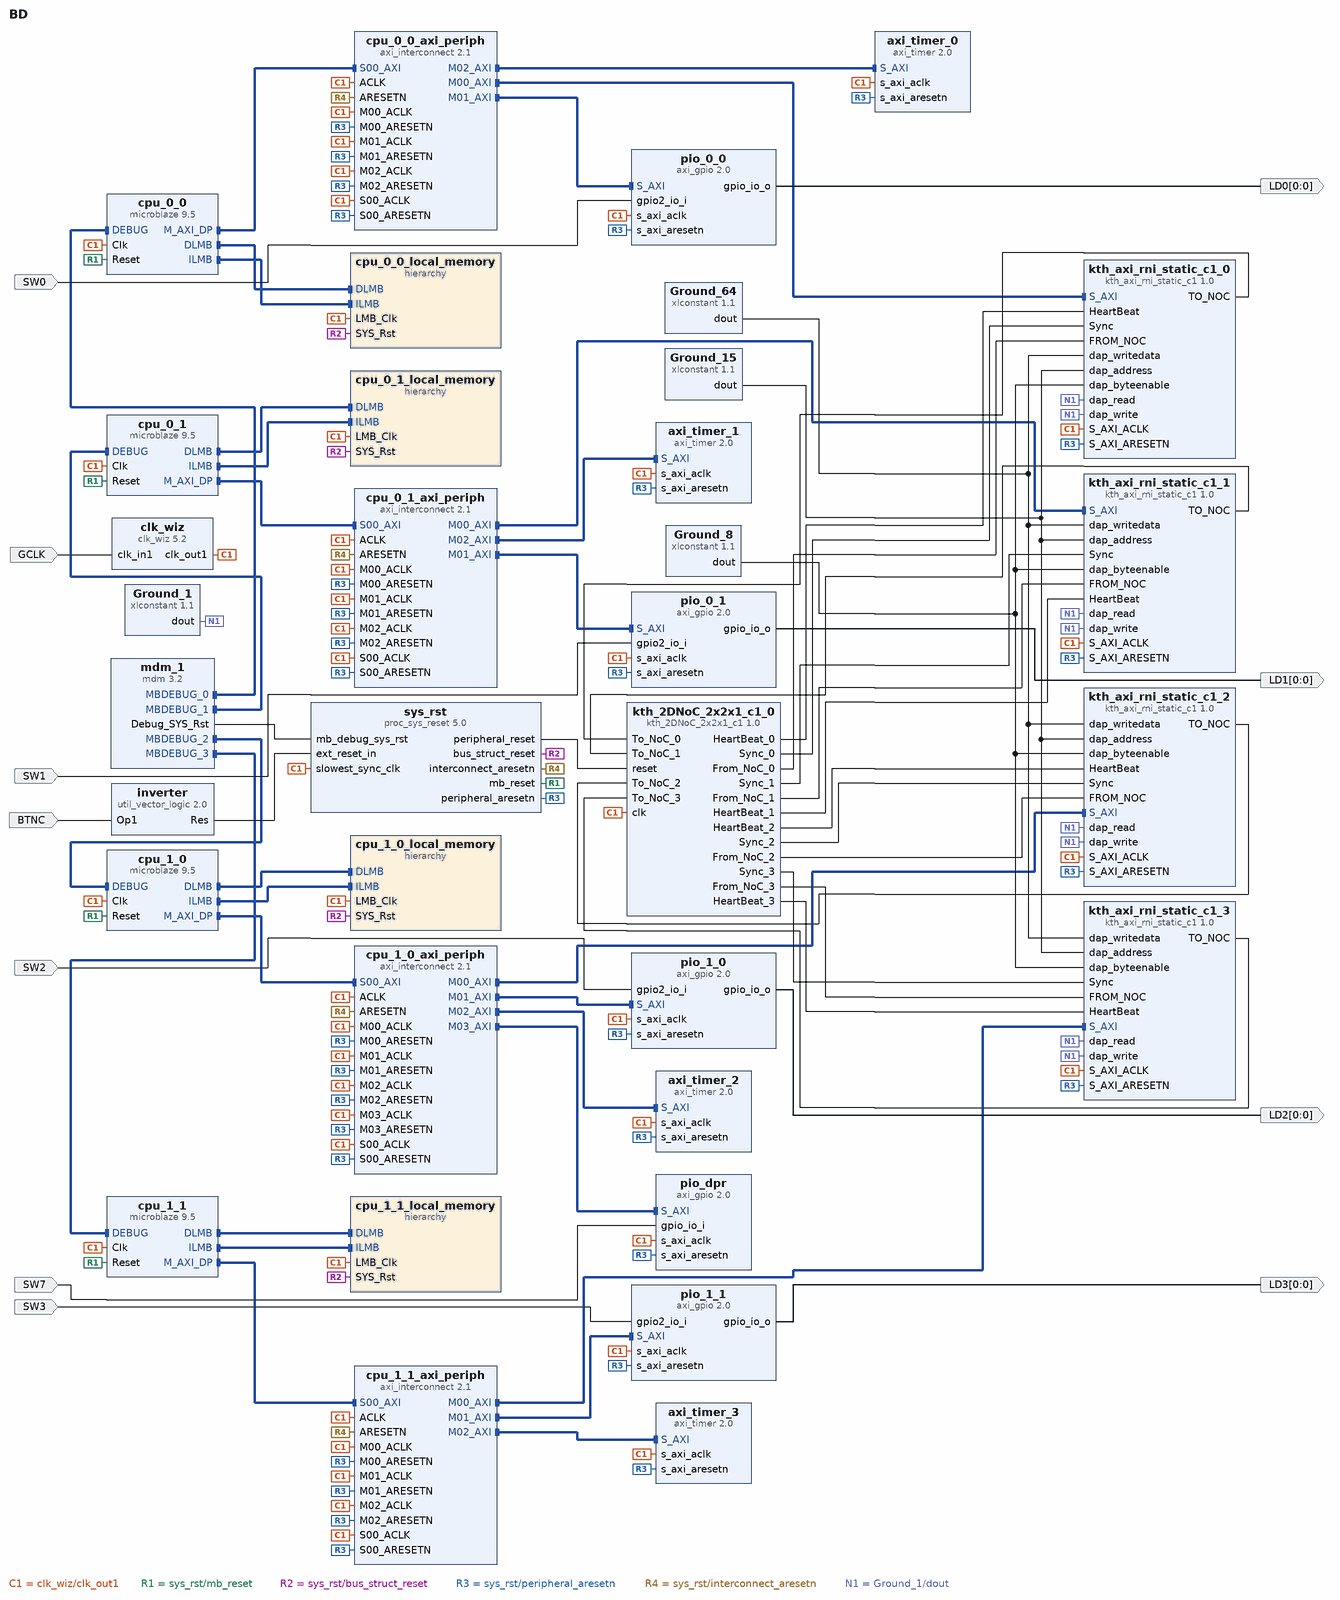
[diagram p0: block diagram of the top level]
# Vivado block design BD, Vivado 2015.4
create_bd_design BD

create_bd_port -dir I GCLK
create_bd_port -dir O -from 0 -to 0 LD0
create_bd_port -dir I SW0
create_bd_port -dir O -from 0 -to 0 LD1
create_bd_port -dir I SW1
create_bd_port -dir O -from 0 -to 0 LD2
create_bd_port -dir I SW2
create_bd_port -dir I SW7
create_bd_port -dir O -from 0 -to 0 LD3
create_bd_port -dir I SW3
create_bd_port -dir I BTNC

create_bd_cell -type ip -vlnv xilinx.com:ip:clk_wiz:5.2 clk_wiz
set_property -dict [list \
  CONFIG.CLKOUT1_REQUESTED_OUT_FREQ 50 \
  CONFIG.USE_LOCKED false \
  CONFIG.USE_RESET false \
  CONFIG.MMCM_DIVCLK_DIVIDE 1 \
  CONFIG.MMCM_CLKOUT0_DIVIDE_F 20.000 \
  CONFIG.CLKOUT1_JITTER 151.636 \
] [get_bd_cells clk_wiz]
create_bd_cell -type ip -vlnv xilinx.com:ip:microblaze:9.5 cpu_0_0
set_property -dict {CONFIG.C_D_AXI 1 CONFIG.C_D_LMB 1 CONFIG.C_I_LMB 1 CONFIG.C_DEBUG_ENABLED 1} [get_bd_cells cpu_0_0]
create_bd_cell -type ip -vlnv kth.se:tage:kth_axi_rni_static_c1:1.0 kth_axi_rni_static_c1_0
set_property -dict {CONFIG.rni_pos 0 CONFIG.use_64bit 0 CONFIG.rni_number 0} [get_bd_cells kth_axi_rni_static_c1_0]
create_bd_cell -type ip -vlnv xilinx.com:ip:axi_gpio:2.0 pio_0_0
set_property -dict [list \
  CONFIG.C_GPIO_WIDTH 1 \
  CONFIG.C_GPIO2_WIDTH 1 \
  CONFIG.C_IS_DUAL 1 \
  CONFIG.C_ALL_INPUTS 0 \
  CONFIG.C_ALL_INPUTS_2 1 \
  CONFIG.C_ALL_OUTPUTS 1 \
] [get_bd_cells pio_0_0]
create_bd_cell -type ip -vlnv xilinx.com:ip:axi_timer:2.0 axi_timer_0
create_bd_cell -type hier cpu_0_0_local_memory
create_bd_cell -type ip -vlnv xilinx.com:ip:mdm:3.2 mdm_1
set_property -dict {CONFIG.C_MB_DBG_PORTS 4} [get_bd_cells mdm_1]
create_bd_cell -type ip -vlnv xilinx.com:ip:proc_sys_reset:5.0 sys_rst
create_bd_cell -type ip -vlnv xilinx.com:ip:axi_interconnect:2.1 cpu_0_0_axi_periph
set_property -dict {CONFIG.NUM_MI 3} [get_bd_cells cpu_0_0_axi_periph]
create_bd_cell -type ip -vlnv xilinx.com:ip:microblaze:9.5 cpu_0_1
set_property -dict {CONFIG.C_D_AXI 1 CONFIG.C_D_LMB 1 CONFIG.C_I_LMB 1 CONFIG.C_DEBUG_ENABLED 1} [get_bd_cells cpu_0_1]
create_bd_cell -type ip -vlnv kth.se:tage:kth_axi_rni_static_c1:1.0 kth_axi_rni_static_c1_1
set_property -dict {CONFIG.rni_pos 1 CONFIG.use_64bit 0 CONFIG.rni_number 1} [get_bd_cells kth_axi_rni_static_c1_1]
create_bd_cell -type ip -vlnv xilinx.com:ip:axi_gpio:2.0 pio_0_1
set_property -dict [list \
  CONFIG.C_GPIO_WIDTH 1 \
  CONFIG.C_GPIO2_WIDTH 1 \
  CONFIG.C_IS_DUAL 1 \
  CONFIG.C_ALL_INPUTS 0 \
  CONFIG.C_ALL_INPUTS_2 1 \
  CONFIG.C_ALL_OUTPUTS 1 \
] [get_bd_cells pio_0_1]
create_bd_cell -type ip -vlnv xilinx.com:ip:axi_timer:2.0 axi_timer_1
create_bd_cell -type hier cpu_0_1_local_memory
create_bd_cell -type ip -vlnv xilinx.com:ip:axi_interconnect:2.1 cpu_0_1_axi_periph
set_property -dict {CONFIG.NUM_MI 3} [get_bd_cells cpu_0_1_axi_periph]
create_bd_cell -type ip -vlnv xilinx.com:ip:microblaze:9.5 cpu_1_0
set_property -dict {CONFIG.C_D_AXI 1 CONFIG.C_D_LMB 1 CONFIG.C_I_LMB 1 CONFIG.C_DEBUG_ENABLED 1} [get_bd_cells cpu_1_0]
create_bd_cell -type ip -vlnv kth.se:tage:kth_axi_rni_static_c1:1.0 kth_axi_rni_static_c1_2
set_property -dict {CONFIG.rni_pos 2 CONFIG.use_64bit 0 CONFIG.rni_number 2} [get_bd_cells kth_axi_rni_static_c1_2]
create_bd_cell -type ip -vlnv xilinx.com:ip:axi_gpio:2.0 pio_1_0
set_property -dict [list \
  CONFIG.C_GPIO_WIDTH 1 \
  CONFIG.C_GPIO2_WIDTH 1 \
  CONFIG.C_IS_DUAL 1 \
  CONFIG.C_ALL_INPUTS 0 \
  CONFIG.C_ALL_INPUTS_2 1 \
  CONFIG.C_ALL_OUTPUTS 1 \
] [get_bd_cells pio_1_0]
create_bd_cell -type ip -vlnv xilinx.com:ip:axi_timer:2.0 axi_timer_2
create_bd_cell -type hier cpu_1_0_local_memory
create_bd_cell -type ip -vlnv xilinx.com:ip:axi_interconnect:2.1 cpu_1_0_axi_periph
set_property -dict {CONFIG.NUM_MI 4} [get_bd_cells cpu_1_0_axi_periph]
create_bd_cell -type ip -vlnv xilinx.com:ip:axi_gpio:2.0 pio_dpr
set_property -dict {CONFIG.C_GPIO_WIDTH 1 CONFIG.C_IS_DUAL 0 CONFIG.C_ALL_INPUTS 1} [get_bd_cells pio_dpr]
create_bd_cell -type ip -vlnv xilinx.com:ip:microblaze:9.5 cpu_1_1
set_property -dict {CONFIG.C_D_AXI 1 CONFIG.C_D_LMB 1 CONFIG.C_I_LMB 1 CONFIG.C_DEBUG_ENABLED 1} [get_bd_cells cpu_1_1]
create_bd_cell -type ip -vlnv kth.se:tage:kth_axi_rni_static_c1:1.0 kth_axi_rni_static_c1_3
set_property -dict {CONFIG.rni_pos 3 CONFIG.use_64bit 0 CONFIG.rni_number 3} [get_bd_cells kth_axi_rni_static_c1_3]
create_bd_cell -type ip -vlnv xilinx.com:ip:axi_gpio:2.0 pio_1_1
set_property -dict [list \
  CONFIG.C_GPIO_WIDTH 1 \
  CONFIG.C_GPIO2_WIDTH 1 \
  CONFIG.C_IS_DUAL 1 \
  CONFIG.C_ALL_INPUTS 0 \
  CONFIG.C_ALL_INPUTS_2 1 \
  CONFIG.C_ALL_OUTPUTS 1 \
] [get_bd_cells pio_1_1]
create_bd_cell -type ip -vlnv xilinx.com:ip:axi_timer:2.0 axi_timer_3
create_bd_cell -type hier cpu_1_1_local_memory
create_bd_cell -type ip -vlnv xilinx.com:ip:axi_interconnect:2.1 cpu_1_1_axi_periph
set_property -dict {CONFIG.NUM_MI 3} [get_bd_cells cpu_1_1_axi_periph]
create_bd_cell -type ip -vlnv xilinx.com:ip:util_vector_logic:2.0 inverter
set_property -dict {CONFIG.C_SIZE 1 CONFIG.C_OPERATION not} [get_bd_cells inverter]
create_bd_cell -type ip -vlnv kth.se:tage:kth_2DNoC_2x2x1_c1:1.0 kth_2DNoC_2x2x1_c1_0
set_property -dict {CONFIG.HeartBeatTimerConst 500} [get_bd_cells kth_2DNoC_2x2x1_c1_0]
create_bd_cell -type ip -vlnv xilinx.com:ip:xlconstant:1.1 Ground_1
set_property -dict {CONFIG.CONST_VAL 0} [get_bd_cells Ground_1]
create_bd_cell -type ip -vlnv xilinx.com:ip:xlconstant:1.1 Ground_8
set_property -dict {CONFIG.CONST_WIDTH 8 CONFIG.CONST_VAL 0} [get_bd_cells Ground_8]
create_bd_cell -type ip -vlnv xilinx.com:ip:xlconstant:1.1 Ground_15
set_property -dict {CONFIG.CONST_WIDTH 15 CONFIG.CONST_VAL 0} [get_bd_cells Ground_15]
create_bd_cell -type ip -vlnv xilinx.com:ip:xlconstant:1.1 Ground_64
set_property -dict {CONFIG.CONST_WIDTH 64 CONFIG.CONST_VAL 0} [get_bd_cells Ground_64]

# ---- hierarchy /cpu_0_0_local_memory ----
current_bd_instance /cpu_0_0_local_memory
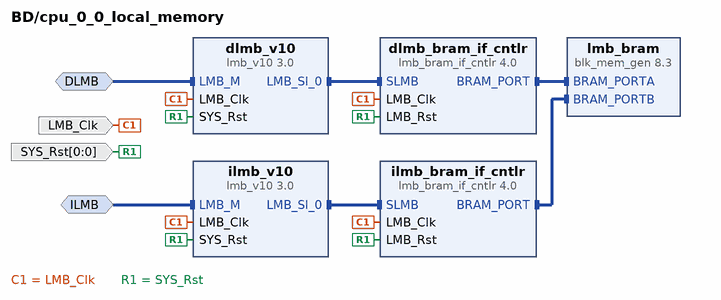
[diagram p1: block diagram inside /cpu_0_0_local_memory]
create_bd_intf_pin -mode MirroredMaster -vlnv xilinx.com:interface:lmb_rtl:1.0 DLMB
create_bd_intf_pin -mode MirroredMaster -vlnv xilinx.com:interface:lmb_rtl:1.0 ILMB
create_bd_pin -dir I -type clk LMB_Clk
create_bd_pin -dir I -from 0 -to 0 -type rst SYS_Rst

create_bd_cell -type ip -vlnv xilinx.com:ip:lmb_v10:3.0 dlmb_v10
create_bd_cell -type ip -vlnv xilinx.com:ip:lmb_v10:3.0 ilmb_v10
create_bd_cell -type ip -vlnv xilinx.com:ip:lmb_bram_if_cntlr:4.0 dlmb_bram_if_cntlr
set_property -dict {CONFIG.C_ECC 0} [get_bd_cells dlmb_bram_if_cntlr]
create_bd_cell -type ip -vlnv xilinx.com:ip:lmb_bram_if_cntlr:4.0 ilmb_bram_if_cntlr
set_property -dict {CONFIG.C_ECC 0} [get_bd_cells ilmb_bram_if_cntlr]
create_bd_cell -type ip -vlnv xilinx.com:ip:blk_mem_gen:8.3 lmb_bram
set_property -dict {CONFIG.Memory_Type True_Dual_Port_RAM CONFIG.use_bram_block BRAM_Controller} [get_bd_cells lmb_bram]

# ---- hierarchy /cpu_0_1_local_memory ----
current_bd_instance /cpu_0_1_local_memory
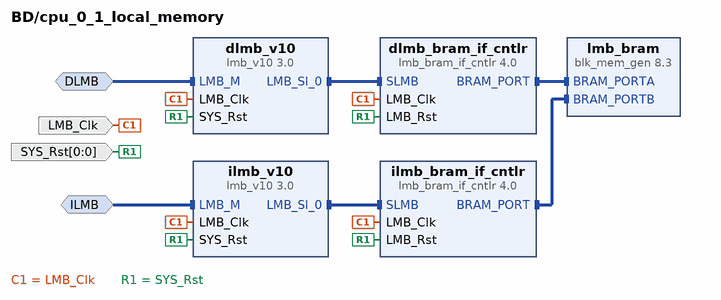
[diagram p2: block diagram inside /cpu_0_1_local_memory]
create_bd_intf_pin -mode MirroredMaster -vlnv xilinx.com:interface:lmb_rtl:1.0 DLMB
create_bd_intf_pin -mode MirroredMaster -vlnv xilinx.com:interface:lmb_rtl:1.0 ILMB
create_bd_pin -dir I -type clk LMB_Clk
create_bd_pin -dir I -from 0 -to 0 -type rst SYS_Rst

create_bd_cell -type ip -vlnv xilinx.com:ip:lmb_v10:3.0 dlmb_v10
create_bd_cell -type ip -vlnv xilinx.com:ip:lmb_v10:3.0 ilmb_v10
create_bd_cell -type ip -vlnv xilinx.com:ip:lmb_bram_if_cntlr:4.0 dlmb_bram_if_cntlr
set_property -dict {CONFIG.C_ECC 0} [get_bd_cells dlmb_bram_if_cntlr]
create_bd_cell -type ip -vlnv xilinx.com:ip:lmb_bram_if_cntlr:4.0 ilmb_bram_if_cntlr
set_property -dict {CONFIG.C_ECC 0} [get_bd_cells ilmb_bram_if_cntlr]
create_bd_cell -type ip -vlnv xilinx.com:ip:blk_mem_gen:8.3 lmb_bram
set_property -dict {CONFIG.Memory_Type True_Dual_Port_RAM CONFIG.use_bram_block BRAM_Controller} [get_bd_cells lmb_bram]

# ---- hierarchy /cpu_1_0_local_memory ----
current_bd_instance /cpu_1_0_local_memory
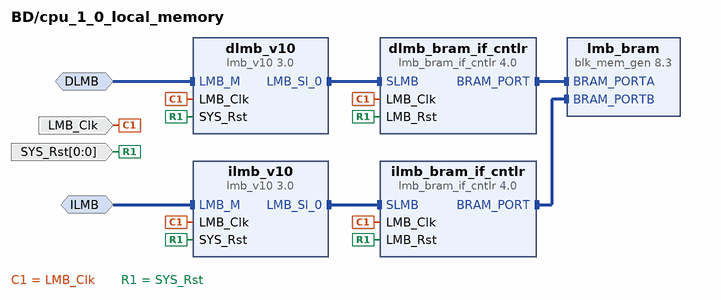
[diagram p3: block diagram inside /cpu_1_0_local_memory]
create_bd_intf_pin -mode MirroredMaster -vlnv xilinx.com:interface:lmb_rtl:1.0 DLMB
create_bd_intf_pin -mode MirroredMaster -vlnv xilinx.com:interface:lmb_rtl:1.0 ILMB
create_bd_pin -dir I -type clk LMB_Clk
create_bd_pin -dir I -from 0 -to 0 -type rst SYS_Rst

create_bd_cell -type ip -vlnv xilinx.com:ip:lmb_v10:3.0 dlmb_v10
create_bd_cell -type ip -vlnv xilinx.com:ip:lmb_v10:3.0 ilmb_v10
create_bd_cell -type ip -vlnv xilinx.com:ip:lmb_bram_if_cntlr:4.0 dlmb_bram_if_cntlr
set_property -dict {CONFIG.C_ECC 0} [get_bd_cells dlmb_bram_if_cntlr]
create_bd_cell -type ip -vlnv xilinx.com:ip:lmb_bram_if_cntlr:4.0 ilmb_bram_if_cntlr
set_property -dict {CONFIG.C_ECC 0} [get_bd_cells ilmb_bram_if_cntlr]
create_bd_cell -type ip -vlnv xilinx.com:ip:blk_mem_gen:8.3 lmb_bram
set_property -dict {CONFIG.Memory_Type True_Dual_Port_RAM CONFIG.use_bram_block BRAM_Controller} [get_bd_cells lmb_bram]

# ---- hierarchy /cpu_1_1_local_memory ----
current_bd_instance /cpu_1_1_local_memory
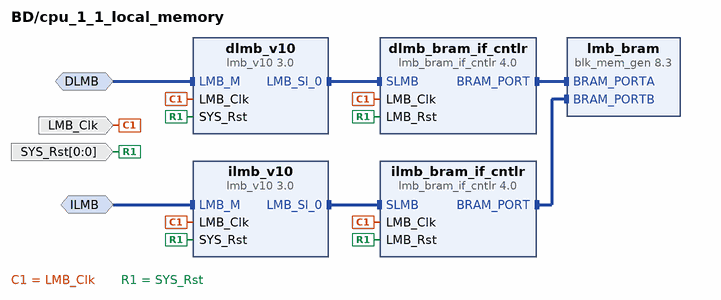
[diagram p4: block diagram inside /cpu_1_1_local_memory]
create_bd_intf_pin -mode MirroredMaster -vlnv xilinx.com:interface:lmb_rtl:1.0 DLMB
create_bd_intf_pin -mode MirroredMaster -vlnv xilinx.com:interface:lmb_rtl:1.0 ILMB
create_bd_pin -dir I -type clk LMB_Clk
create_bd_pin -dir I -from 0 -to 0 -type rst SYS_Rst

create_bd_cell -type ip -vlnv xilinx.com:ip:lmb_v10:3.0 dlmb_v10
create_bd_cell -type ip -vlnv xilinx.com:ip:lmb_v10:3.0 ilmb_v10
create_bd_cell -type ip -vlnv xilinx.com:ip:lmb_bram_if_cntlr:4.0 dlmb_bram_if_cntlr
set_property -dict {CONFIG.C_ECC 0} [get_bd_cells dlmb_bram_if_cntlr]
create_bd_cell -type ip -vlnv xilinx.com:ip:lmb_bram_if_cntlr:4.0 ilmb_bram_if_cntlr
set_property -dict {CONFIG.C_ECC 0} [get_bd_cells ilmb_bram_if_cntlr]
create_bd_cell -type ip -vlnv xilinx.com:ip:blk_mem_gen:8.3 lmb_bram
set_property -dict {CONFIG.Memory_Type True_Dual_Port_RAM CONFIG.use_bram_block BRAM_Controller} [get_bd_cells lmb_bram]

# ---- connections ----

current_bd_instance /cpu_0_0_local_memory
connect_bd_intf_net [get_bd_intf_pins dlmb_v10/LMB_Sl_0] [get_bd_intf_pins dlmb_bram_if_cntlr/SLMB]
connect_bd_intf_net [get_bd_intf_pins ilmb_v10/LMB_Sl_0] [get_bd_intf_pins ilmb_bram_if_cntlr/SLMB]
connect_bd_intf_net [get_bd_intf_pins dlmb_bram_if_cntlr/BRAM_PORT] [get_bd_intf_pins lmb_bram/BRAM_PORTA]
connect_bd_intf_net [get_bd_intf_pins ilmb_bram_if_cntlr/BRAM_PORT] [get_bd_intf_pins lmb_bram/BRAM_PORTB]
connect_bd_intf_net [get_bd_intf_pins DLMB] [get_bd_intf_pins dlmb_v10/LMB_M]
connect_bd_intf_net [get_bd_intf_pins ILMB] [get_bd_intf_pins ilmb_v10/LMB_M]
connect_bd_net -net cpu_0_0_Clk [get_bd_pins LMB_Clk] \
  [get_bd_pins dlmb_v10/LMB_Clk] [get_bd_pins dlmb_bram_if_cntlr/LMB_Clk] [get_bd_pins ilmb_v10/LMB_Clk] \
  [get_bd_pins ilmb_bram_if_cntlr/LMB_Clk]
connect_bd_net [get_bd_pins SYS_Rst] \
  [get_bd_pins dlmb_v10/SYS_Rst] [get_bd_pins dlmb_bram_if_cntlr/LMB_Rst] [get_bd_pins ilmb_v10/SYS_Rst] \
  [get_bd_pins ilmb_bram_if_cntlr/LMB_Rst]

current_bd_instance /cpu_0_1_local_memory
connect_bd_intf_net [get_bd_intf_pins dlmb_v10/LMB_Sl_0] [get_bd_intf_pins dlmb_bram_if_cntlr/SLMB]
connect_bd_intf_net [get_bd_intf_pins ilmb_v10/LMB_Sl_0] [get_bd_intf_pins ilmb_bram_if_cntlr/SLMB]
connect_bd_intf_net [get_bd_intf_pins dlmb_bram_if_cntlr/BRAM_PORT] [get_bd_intf_pins lmb_bram/BRAM_PORTA]
connect_bd_intf_net [get_bd_intf_pins ilmb_bram_if_cntlr/BRAM_PORT] [get_bd_intf_pins lmb_bram/BRAM_PORTB]
connect_bd_intf_net [get_bd_intf_pins DLMB] [get_bd_intf_pins dlmb_v10/LMB_M]
connect_bd_intf_net [get_bd_intf_pins ILMB] [get_bd_intf_pins ilmb_v10/LMB_M]
connect_bd_net -net cpu_0_1_Clk [get_bd_pins LMB_Clk] \
  [get_bd_pins dlmb_v10/LMB_Clk] [get_bd_pins dlmb_bram_if_cntlr/LMB_Clk] [get_bd_pins ilmb_v10/LMB_Clk] \
  [get_bd_pins ilmb_bram_if_cntlr/LMB_Clk]
connect_bd_net [get_bd_pins SYS_Rst] \
  [get_bd_pins dlmb_v10/SYS_Rst] [get_bd_pins dlmb_bram_if_cntlr/LMB_Rst] [get_bd_pins ilmb_v10/SYS_Rst] \
  [get_bd_pins ilmb_bram_if_cntlr/LMB_Rst]

current_bd_instance /cpu_1_0_local_memory
connect_bd_intf_net [get_bd_intf_pins dlmb_v10/LMB_Sl_0] [get_bd_intf_pins dlmb_bram_if_cntlr/SLMB]
connect_bd_intf_net [get_bd_intf_pins ilmb_v10/LMB_Sl_0] [get_bd_intf_pins ilmb_bram_if_cntlr/SLMB]
connect_bd_intf_net [get_bd_intf_pins dlmb_bram_if_cntlr/BRAM_PORT] [get_bd_intf_pins lmb_bram/BRAM_PORTA]
connect_bd_intf_net [get_bd_intf_pins ilmb_bram_if_cntlr/BRAM_PORT] [get_bd_intf_pins lmb_bram/BRAM_PORTB]
connect_bd_intf_net [get_bd_intf_pins DLMB] [get_bd_intf_pins dlmb_v10/LMB_M]
connect_bd_intf_net [get_bd_intf_pins ILMB] [get_bd_intf_pins ilmb_v10/LMB_M]
connect_bd_net -net cpu_1_0_Clk [get_bd_pins LMB_Clk] \
  [get_bd_pins dlmb_v10/LMB_Clk] [get_bd_pins dlmb_bram_if_cntlr/LMB_Clk] [get_bd_pins ilmb_v10/LMB_Clk] \
  [get_bd_pins ilmb_bram_if_cntlr/LMB_Clk]
connect_bd_net [get_bd_pins SYS_Rst] \
  [get_bd_pins dlmb_v10/SYS_Rst] [get_bd_pins dlmb_bram_if_cntlr/LMB_Rst] [get_bd_pins ilmb_v10/SYS_Rst] \
  [get_bd_pins ilmb_bram_if_cntlr/LMB_Rst]

current_bd_instance /cpu_1_1_local_memory
connect_bd_intf_net [get_bd_intf_pins dlmb_v10/LMB_Sl_0] [get_bd_intf_pins dlmb_bram_if_cntlr/SLMB]
connect_bd_intf_net [get_bd_intf_pins ilmb_v10/LMB_Sl_0] [get_bd_intf_pins ilmb_bram_if_cntlr/SLMB]
connect_bd_intf_net [get_bd_intf_pins dlmb_bram_if_cntlr/BRAM_PORT] [get_bd_intf_pins lmb_bram/BRAM_PORTA]
connect_bd_intf_net [get_bd_intf_pins ilmb_bram_if_cntlr/BRAM_PORT] [get_bd_intf_pins lmb_bram/BRAM_PORTB]
connect_bd_intf_net [get_bd_intf_pins DLMB] [get_bd_intf_pins dlmb_v10/LMB_M]
connect_bd_intf_net [get_bd_intf_pins ILMB] [get_bd_intf_pins ilmb_v10/LMB_M]
connect_bd_net -net cpu_1_1_Clk [get_bd_pins LMB_Clk] \
  [get_bd_pins dlmb_v10/LMB_Clk] [get_bd_pins dlmb_bram_if_cntlr/LMB_Clk] [get_bd_pins ilmb_v10/LMB_Clk] \
  [get_bd_pins ilmb_bram_if_cntlr/LMB_Clk]
connect_bd_net [get_bd_pins SYS_Rst] \
  [get_bd_pins dlmb_v10/SYS_Rst] [get_bd_pins dlmb_bram_if_cntlr/LMB_Rst] [get_bd_pins ilmb_v10/SYS_Rst] \
  [get_bd_pins ilmb_bram_if_cntlr/LMB_Rst]

current_bd_instance /
connect_bd_intf_net [get_bd_intf_pins cpu_0_0/DLMB] [get_bd_intf_pins cpu_0_0_local_memory/DLMB]
connect_bd_intf_net [get_bd_intf_pins cpu_0_0/ILMB] [get_bd_intf_pins cpu_0_0_local_memory/ILMB]
connect_bd_intf_net [get_bd_intf_pins mdm_1/MBDEBUG_0] [get_bd_intf_pins cpu_0_0/DEBUG]
connect_bd_intf_net [get_bd_intf_pins cpu_0_0/M_AXI_DP] [get_bd_intf_pins cpu_0_0_axi_periph/S00_AXI]
connect_bd_intf_net [get_bd_intf_pins cpu_0_0_axi_periph/M00_AXI] [get_bd_intf_pins kth_axi_rni_static_c1_0/S_AXI]
connect_bd_intf_net [get_bd_intf_pins cpu_0_0_axi_periph/M01_AXI] [get_bd_intf_pins pio_0_0/S_AXI]
connect_bd_intf_net [get_bd_intf_pins cpu_0_0_axi_periph/M02_AXI] [get_bd_intf_pins axi_timer_0/S_AXI]
connect_bd_intf_net [get_bd_intf_pins cpu_0_1/DLMB] [get_bd_intf_pins cpu_0_1_local_memory/DLMB]
connect_bd_intf_net [get_bd_intf_pins cpu_0_1/ILMB] [get_bd_intf_pins cpu_0_1_local_memory/ILMB]
connect_bd_intf_net [get_bd_intf_pins mdm_1/MBDEBUG_1] [get_bd_intf_pins cpu_0_1/DEBUG]
connect_bd_intf_net [get_bd_intf_pins cpu_0_1/M_AXI_DP] [get_bd_intf_pins cpu_0_1_axi_periph/S00_AXI]
connect_bd_intf_net [get_bd_intf_pins cpu_0_1_axi_periph/M00_AXI] [get_bd_intf_pins kth_axi_rni_static_c1_1/S_AXI]
connect_bd_intf_net [get_bd_intf_pins cpu_0_1_axi_periph/M01_AXI] [get_bd_intf_pins pio_0_1/S_AXI]
connect_bd_intf_net [get_bd_intf_pins cpu_0_1_axi_periph/M02_AXI] [get_bd_intf_pins axi_timer_1/S_AXI]
connect_bd_intf_net [get_bd_intf_pins cpu_1_0/DLMB] [get_bd_intf_pins cpu_1_0_local_memory/DLMB]
connect_bd_intf_net [get_bd_intf_pins cpu_1_0/ILMB] [get_bd_intf_pins cpu_1_0_local_memory/ILMB]
connect_bd_intf_net [get_bd_intf_pins mdm_1/MBDEBUG_2] [get_bd_intf_pins cpu_1_0/DEBUG]
connect_bd_intf_net [get_bd_intf_pins cpu_1_0/M_AXI_DP] [get_bd_intf_pins cpu_1_0_axi_periph/S00_AXI]
connect_bd_intf_net [get_bd_intf_pins cpu_1_0_axi_periph/M00_AXI] [get_bd_intf_pins kth_axi_rni_static_c1_2/S_AXI]
connect_bd_intf_net [get_bd_intf_pins cpu_1_0_axi_periph/M01_AXI] [get_bd_intf_pins pio_1_0/S_AXI]
connect_bd_intf_net [get_bd_intf_pins cpu_1_0_axi_periph/M02_AXI] [get_bd_intf_pins axi_timer_2/S_AXI]
connect_bd_intf_net [get_bd_intf_pins cpu_1_0_axi_periph/M03_AXI] [get_bd_intf_pins pio_dpr/S_AXI]
connect_bd_intf_net [get_bd_intf_pins cpu_1_1/DLMB] [get_bd_intf_pins cpu_1_1_local_memory/DLMB]
connect_bd_intf_net [get_bd_intf_pins cpu_1_1/ILMB] [get_bd_intf_pins cpu_1_1_local_memory/ILMB]
connect_bd_intf_net [get_bd_intf_pins mdm_1/MBDEBUG_3] [get_bd_intf_pins cpu_1_1/DEBUG]
connect_bd_intf_net [get_bd_intf_pins cpu_1_1/M_AXI_DP] [get_bd_intf_pins cpu_1_1_axi_periph/S00_AXI]
connect_bd_intf_net [get_bd_intf_pins cpu_1_1_axi_periph/M00_AXI] [get_bd_intf_pins kth_axi_rni_static_c1_3/S_AXI]
connect_bd_intf_net [get_bd_intf_pins cpu_1_1_axi_periph/M01_AXI] [get_bd_intf_pins pio_1_1/S_AXI]
connect_bd_intf_net [get_bd_intf_pins cpu_1_1_axi_periph/M02_AXI] [get_bd_intf_pins axi_timer_3/S_AXI]
connect_bd_net [get_bd_ports GCLK] [get_bd_pins clk_wiz/clk_in1]
connect_bd_net -net cpu_1_1_Clk [get_bd_pins clk_wiz/clk_out1] \
  [get_bd_pins cpu_0_0/Clk] [get_bd_pins cpu_0_0_local_memory/LMB_Clk] [get_bd_pins sys_rst/slowest_sync_clk] \
  [get_bd_pins cpu_0_0_axi_periph/S00_ACLK] [get_bd_pins cpu_0_0_axi_periph/ACLK] \
  [get_bd_pins kth_axi_rni_static_c1_0/S_AXI_ACLK] [get_bd_pins cpu_0_0_axi_periph/M00_ACLK] [get_bd_pins pio_0_0/s_axi_aclk] \
  [get_bd_pins cpu_0_0_axi_periph/M01_ACLK] [get_bd_pins axi_timer_0/s_axi_aclk] [get_bd_pins cpu_0_0_axi_periph/M02_ACLK] \
  [get_bd_pins cpu_0_1/Clk] [get_bd_pins cpu_0_1_local_memory/LMB_Clk] [get_bd_pins cpu_0_1_axi_periph/S00_ACLK] \
  [get_bd_pins cpu_0_1_axi_periph/ACLK] [get_bd_pins kth_axi_rni_static_c1_1/S_AXI_ACLK] \
  [get_bd_pins cpu_0_1_axi_periph/M00_ACLK] [get_bd_pins pio_0_1/s_axi_aclk] [get_bd_pins cpu_0_1_axi_periph/M01_ACLK] \
  [get_bd_pins axi_timer_1/s_axi_aclk] [get_bd_pins cpu_0_1_axi_periph/M02_ACLK] [get_bd_pins cpu_1_0/Clk] \
  [get_bd_pins cpu_1_0_local_memory/LMB_Clk] [get_bd_pins cpu_1_0_axi_periph/S00_ACLK] [get_bd_pins cpu_1_0_axi_periph/ACLK] \
  [get_bd_pins kth_axi_rni_static_c1_2/S_AXI_ACLK] [get_bd_pins cpu_1_0_axi_periph/M00_ACLK] [get_bd_pins pio_1_0/s_axi_aclk] \
  [get_bd_pins cpu_1_0_axi_periph/M01_ACLK] [get_bd_pins axi_timer_2/s_axi_aclk] [get_bd_pins cpu_1_0_axi_periph/M02_ACLK] \
  [get_bd_pins pio_dpr/s_axi_aclk] [get_bd_pins cpu_1_0_axi_periph/M03_ACLK] [get_bd_pins cpu_1_1/Clk] \
  [get_bd_pins cpu_1_1_local_memory/LMB_Clk] [get_bd_pins cpu_1_1_axi_periph/S00_ACLK] [get_bd_pins cpu_1_1_axi_periph/ACLK] \
  [get_bd_pins kth_axi_rni_static_c1_3/S_AXI_ACLK] [get_bd_pins cpu_1_1_axi_periph/M00_ACLK] [get_bd_pins pio_1_1/s_axi_aclk] \
  [get_bd_pins cpu_1_1_axi_periph/M01_ACLK] [get_bd_pins axi_timer_3/s_axi_aclk] [get_bd_pins cpu_1_1_axi_periph/M02_ACLK] \
  [get_bd_pins kth_2DNoC_2x2x1_c1_0/clk]
connect_bd_net -net rst_clk_wiz_50M_mb_reset [get_bd_pins sys_rst/mb_reset] \
  [get_bd_pins cpu_0_0/Reset] [get_bd_pins cpu_0_1/Reset] [get_bd_pins cpu_1_0/Reset] [get_bd_pins cpu_1_1/Reset]
connect_bd_net -net rst_clk_wiz_50M_bus_struct_reset [get_bd_pins sys_rst/bus_struct_reset] \
  [get_bd_pins cpu_0_0_local_memory/SYS_Rst] [get_bd_pins cpu_0_1_local_memory/SYS_Rst] \
  [get_bd_pins cpu_1_0_local_memory/SYS_Rst] [get_bd_pins cpu_1_1_local_memory/SYS_Rst]
connect_bd_net [get_bd_pins mdm_1/Debug_SYS_Rst] [get_bd_pins sys_rst/mb_debug_sys_rst]
connect_bd_net [get_bd_pins pio_0_0/gpio_io_o] [get_bd_ports LD0]
connect_bd_net -net SW0_1 [get_bd_ports SW0] [get_bd_pins pio_0_0/gpio2_io_i]
connect_bd_net -net rst_clk_wiz_50M_peripheral_aresetn [get_bd_pins sys_rst/peripheral_aresetn] \
  [get_bd_pins cpu_0_0_axi_periph/S00_ARESETN] [get_bd_pins kth_axi_rni_static_c1_0/S_AXI_ARESETN] \
  [get_bd_pins cpu_0_0_axi_periph/M00_ARESETN] [get_bd_pins pio_0_0/s_axi_aresetn] \
  [get_bd_pins cpu_0_0_axi_periph/M01_ARESETN] [get_bd_pins axi_timer_0/s_axi_aresetn] \
  [get_bd_pins cpu_0_0_axi_periph/M02_ARESETN] [get_bd_pins cpu_0_1_axi_periph/S00_ARESETN] \
  [get_bd_pins kth_axi_rni_static_c1_1/S_AXI_ARESETN] [get_bd_pins cpu_0_1_axi_periph/M00_ARESETN] \
  [get_bd_pins pio_0_1/s_axi_aresetn] [get_bd_pins cpu_0_1_axi_periph/M01_ARESETN] [get_bd_pins axi_timer_1/s_axi_aresetn] \
  [get_bd_pins cpu_0_1_axi_periph/M02_ARESETN] [get_bd_pins cpu_1_0_axi_periph/S00_ARESETN] \
  [get_bd_pins kth_axi_rni_static_c1_2/S_AXI_ARESETN] [get_bd_pins cpu_1_0_axi_periph/M00_ARESETN] \
  [get_bd_pins pio_1_0/s_axi_aresetn] [get_bd_pins cpu_1_0_axi_periph/M01_ARESETN] [get_bd_pins axi_timer_2/s_axi_aresetn] \
  [get_bd_pins cpu_1_0_axi_periph/M02_ARESETN] [get_bd_pins pio_dpr/s_axi_aresetn] \
  [get_bd_pins cpu_1_0_axi_periph/M03_ARESETN] [get_bd_pins cpu_1_1_axi_periph/S00_ARESETN] \
  [get_bd_pins kth_axi_rni_static_c1_3/S_AXI_ARESETN] [get_bd_pins cpu_1_1_axi_periph/M00_ARESETN] \
  [get_bd_pins pio_1_1/s_axi_aresetn] [get_bd_pins cpu_1_1_axi_periph/M01_ARESETN] [get_bd_pins axi_timer_3/s_axi_aresetn] \
  [get_bd_pins cpu_1_1_axi_periph/M02_ARESETN]
connect_bd_net -net rst_clk_wiz_50M_interconnect_aresetn [get_bd_pins sys_rst/interconnect_aresetn] \
  [get_bd_pins cpu_0_0_axi_periph/ARESETN] [get_bd_pins cpu_0_1_axi_periph/ARESETN] [get_bd_pins cpu_1_0_axi_periph/ARESETN] \
  [get_bd_pins cpu_1_1_axi_periph/ARESETN]
connect_bd_net [get_bd_pins pio_0_1/gpio_io_o] [get_bd_ports LD1]
connect_bd_net -net SW1_1 [get_bd_ports SW1] [get_bd_pins pio_0_1/gpio2_io_i]
connect_bd_net [get_bd_pins pio_1_0/gpio_io_o] [get_bd_ports LD2]
connect_bd_net -net SW2_1 [get_bd_ports SW2] [get_bd_pins pio_1_0/gpio2_io_i]
connect_bd_net -net SW7_1 [get_bd_ports SW7] [get_bd_pins pio_dpr/gpio_io_i]
connect_bd_net [get_bd_pins pio_1_1/gpio_io_o] [get_bd_ports LD3]
connect_bd_net -net SW3_1 [get_bd_ports SW3] [get_bd_pins pio_1_1/gpio2_io_i]
connect_bd_net [get_bd_pins inverter/Res] [get_bd_pins sys_rst/ext_reset_in]
connect_bd_net [get_bd_ports BTNC] [get_bd_pins inverter/Op1]
connect_bd_net [get_bd_pins sys_rst/peripheral_reset] [get_bd_pins kth_2DNoC_2x2x1_c1_0/reset]
connect_bd_net [get_bd_pins Ground_64/dout] \
  [get_bd_pins kth_axi_rni_static_c1_0/dap_writedata] [get_bd_pins kth_axi_rni_static_c1_2/dap_writedata] \
  [get_bd_pins kth_axi_rni_static_c1_1/dap_writedata] [get_bd_pins kth_axi_rni_static_c1_3/dap_writedata]
connect_bd_net [get_bd_pins Ground_15/dout] \
  [get_bd_pins kth_axi_rni_static_c1_0/dap_address] [get_bd_pins kth_axi_rni_static_c1_2/dap_address] \
  [get_bd_pins kth_axi_rni_static_c1_1/dap_address] [get_bd_pins kth_axi_rni_static_c1_3/dap_address]
connect_bd_net [get_bd_pins Ground_8/dout] \
  [get_bd_pins kth_axi_rni_static_c1_0/dap_byteenable] [get_bd_pins kth_axi_rni_static_c1_2/dap_byteenable] \
  [get_bd_pins kth_axi_rni_static_c1_3/dap_byteenable] [get_bd_pins kth_axi_rni_static_c1_1/dap_byteenable]
connect_bd_net [get_bd_pins Ground_1/dout] \
  [get_bd_pins kth_axi_rni_static_c1_0/dap_read] [get_bd_pins kth_axi_rni_static_c1_0/dap_write] \
  [get_bd_pins kth_axi_rni_static_c1_2/dap_write] [get_bd_pins kth_axi_rni_static_c1_2/dap_read] \
  [get_bd_pins kth_axi_rni_static_c1_1/dap_write] [get_bd_pins kth_axi_rni_static_c1_1/dap_read] \
  [get_bd_pins kth_axi_rni_static_c1_3/dap_read] [get_bd_pins kth_axi_rni_static_c1_3/dap_write]
connect_bd_net [get_bd_pins kth_axi_rni_static_c1_0/TO_NOC] [get_bd_pins kth_2DNoC_2x2x1_c1_0/To_NoC_0]
connect_bd_net [get_bd_pins kth_2DNoC_2x2x1_c1_0/HeartBeat_0] [get_bd_pins kth_axi_rni_static_c1_0/HeartBeat]
connect_bd_net [get_bd_pins kth_2DNoC_2x2x1_c1_0/Sync_0] [get_bd_pins kth_axi_rni_static_c1_0/Sync]
connect_bd_net [get_bd_pins kth_2DNoC_2x2x1_c1_0/From_NoC_0] [get_bd_pins kth_axi_rni_static_c1_0/FROM_NOC]
connect_bd_net [get_bd_pins kth_axi_rni_static_c1_1/TO_NOC] [get_bd_pins kth_2DNoC_2x2x1_c1_0/To_NoC_1]
connect_bd_net [get_bd_pins kth_2DNoC_2x2x1_c1_0/Sync_1] [get_bd_pins kth_axi_rni_static_c1_1/Sync]
connect_bd_net [get_bd_pins kth_2DNoC_2x2x1_c1_0/From_NoC_1] [get_bd_pins kth_axi_rni_static_c1_1/FROM_NOC]
connect_bd_net [get_bd_pins kth_2DNoC_2x2x1_c1_0/HeartBeat_1] [get_bd_pins kth_axi_rni_static_c1_1/HeartBeat]
connect_bd_net [get_bd_pins kth_2DNoC_2x2x1_c1_0/HeartBeat_2] [get_bd_pins kth_axi_rni_static_c1_2/HeartBeat]
connect_bd_net [get_bd_pins kth_2DNoC_2x2x1_c1_0/Sync_2] [get_bd_pins kth_axi_rni_static_c1_2/Sync]
connect_bd_net [get_bd_pins kth_axi_rni_static_c1_2/TO_NOC] [get_bd_pins kth_2DNoC_2x2x1_c1_0/To_NoC_2]
connect_bd_net [get_bd_pins kth_axi_rni_static_c1_3/TO_NOC] [get_bd_pins kth_2DNoC_2x2x1_c1_0/To_NoC_3]
connect_bd_net [get_bd_pins kth_2DNoC_2x2x1_c1_0/Sync_3] [get_bd_pins kth_axi_rni_static_c1_3/Sync]
connect_bd_net [get_bd_pins kth_2DNoC_2x2x1_c1_0/From_NoC_2] [get_bd_pins kth_axi_rni_static_c1_2/FROM_NOC]
connect_bd_net [get_bd_pins kth_2DNoC_2x2x1_c1_0/From_NoC_3] [get_bd_pins kth_axi_rni_static_c1_3/FROM_NOC]
connect_bd_net [get_bd_pins kth_2DNoC_2x2x1_c1_0/HeartBeat_3] [get_bd_pins kth_axi_rni_static_c1_3/HeartBeat]

# ---- address map ----
assign_bd_address -offset 0x00000000 -range 64K -target_address_space [get_bd_addr_spaces cpu_0_0/Data] [get_bd_addr_segs cpu_0_0_local_memory/dlmb_bram_if_cntlr/SLMB/Mem]
assign_bd_address -offset 0x40000000 -range 64K -target_address_space [get_bd_addr_spaces cpu_0_0/Data] [get_bd_addr_segs pio_0_0/S_AXI/Reg]
assign_bd_address -offset 0x50000000 -range 64K -target_address_space [get_bd_addr_spaces cpu_0_0/Data] [get_bd_addr_segs axi_timer_0/S_AXI/Reg]
assign_bd_address -offset 0x70020000 -range 128K -target_address_space [get_bd_addr_spaces cpu_0_0/Data] [get_bd_addr_segs kth_axi_rni_static_c1_0/S_AXI/reg0]
assign_bd_address -offset 0x00000000 -range 64K -target_address_space [get_bd_addr_spaces cpu_0_0/Instruction] [get_bd_addr_segs cpu_0_0_local_memory/ilmb_bram_if_cntlr/SLMB/Mem]
assign_bd_address -offset 0x00000000 -range 64K -target_address_space [get_bd_addr_spaces cpu_0_1/Data] [get_bd_addr_segs cpu_0_1_local_memory/dlmb_bram_if_cntlr/SLMB/Mem]
assign_bd_address -offset 0x40000000 -range 64K -target_address_space [get_bd_addr_spaces cpu_0_1/Data] [get_bd_addr_segs pio_0_1/S_AXI/Reg]
assign_bd_address -offset 0x50000000 -range 64K -target_address_space [get_bd_addr_spaces cpu_0_1/Data] [get_bd_addr_segs axi_timer_1/S_AXI/Reg]
assign_bd_address -offset 0x70020000 -range 128K -target_address_space [get_bd_addr_spaces cpu_0_1/Data] [get_bd_addr_segs kth_axi_rni_static_c1_1/S_AXI/reg0]
assign_bd_address -offset 0x00000000 -range 64K -target_address_space [get_bd_addr_spaces cpu_0_1/Instruction] [get_bd_addr_segs cpu_0_1_local_memory/ilmb_bram_if_cntlr/SLMB/Mem]
assign_bd_address -offset 0x00000000 -range 64K -target_address_space [get_bd_addr_spaces cpu_1_0/Data] [get_bd_addr_segs cpu_1_0_local_memory/dlmb_bram_if_cntlr/SLMB/Mem]
assign_bd_address -offset 0x40000000 -range 64K -target_address_space [get_bd_addr_spaces cpu_1_0/Data] [get_bd_addr_segs pio_1_0/S_AXI/Reg]
assign_bd_address -offset 0x40010000 -range 64K -target_address_space [get_bd_addr_spaces cpu_1_0/Data] [get_bd_addr_segs pio_dpr/S_AXI/Reg]
assign_bd_address -offset 0x50000000 -range 64K -target_address_space [get_bd_addr_spaces cpu_1_0/Data] [get_bd_addr_segs axi_timer_2/S_AXI/Reg]
assign_bd_address -offset 0x70020000 -range 128K -target_address_space [get_bd_addr_spaces cpu_1_0/Data] [get_bd_addr_segs kth_axi_rni_static_c1_2/S_AXI/reg0]
assign_bd_address -offset 0x00000000 -range 64K -target_address_space [get_bd_addr_spaces cpu_1_0/Instruction] [get_bd_addr_segs cpu_1_0_local_memory/ilmb_bram_if_cntlr/SLMB/Mem]
assign_bd_address -offset 0x00000000 -range 64K -target_address_space [get_bd_addr_spaces cpu_1_1/Data] [get_bd_addr_segs cpu_1_1_local_memory/dlmb_bram_if_cntlr/SLMB/Mem]
assign_bd_address -offset 0x40000000 -range 64K -target_address_space [get_bd_addr_spaces cpu_1_1/Data] [get_bd_addr_segs pio_1_1/S_AXI/Reg]
assign_bd_address -offset 0x50000000 -range 64K -target_address_space [get_bd_addr_spaces cpu_1_1/Data] [get_bd_addr_segs axi_timer_3/S_AXI/Reg]
assign_bd_address -offset 0x70020000 -range 128K -target_address_space [get_bd_addr_spaces cpu_1_1/Data] [get_bd_addr_segs kth_axi_rni_static_c1_3/S_AXI/reg0]
assign_bd_address -offset 0x00000000 -range 64K -target_address_space [get_bd_addr_spaces cpu_1_1/Instruction] [get_bd_addr_segs cpu_1_1_local_memory/ilmb_bram_if_cntlr/SLMB/Mem]

validate_bd_design
save_bd_design
